# Altium schematic sheet LCD.SchDoc
size A; DocumentNumber: 7; SheetNumber: 7; SheetTotal: 12
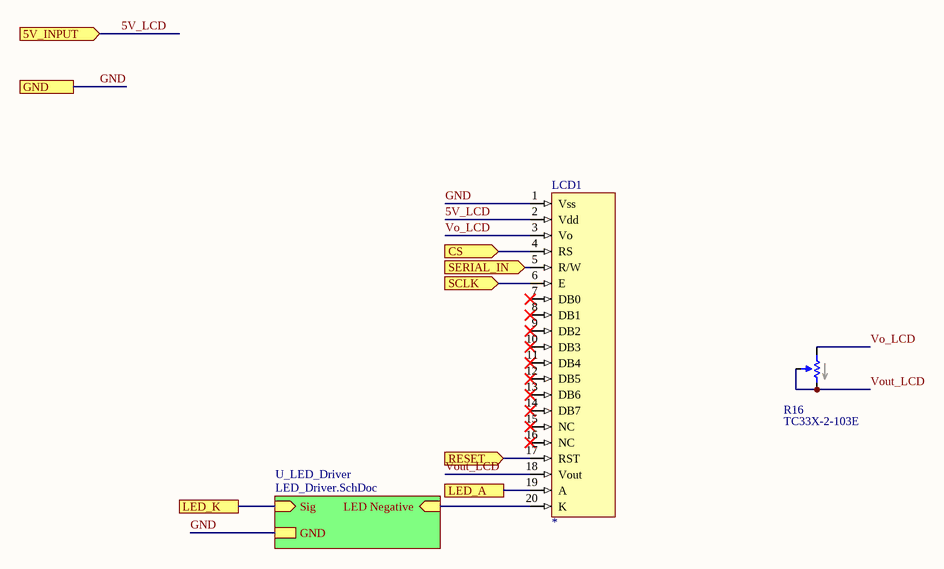
[diagram p0: LCD.SchDoc]

## Parts
LCD1  *  [CFAG12864S]
R16  TC33X-2-103E  [35WR]

## Sub-sheets
U_LED_Driver = LED_Driver.SchDoc: LED Negative (in), Sig (in), GND

## Ports
5V_INPUT (in), CS (in), GND, LED_A, LED_K, RESET (in), SCLK (in), SERIAL_IN (in)

## Nets
5V_LCD: LCD1.2(Vdd) ; port 5V_INPUT
CS: LCD1.4(RS) ; port CS
GND: LCD1.1(Vss) ; port GND, sheet U_LED_Driver/GND
LED_A: LCD1.19(A) ; port LED_A
LED_K: port LED_K, sheet U_LED_Driver/Sig
RESET: LCD1.17(RST) ; port RESET
SCLK: LCD1.6(E) ; port SCLK
SERIAL_IN: LCD1.5(R/W) ; port SERIAL_IN
Vo_LCD: LCD1.3(Vo) R16.1
Vout_LCD: LCD1.18(Vout) R16.2 R16.3
NetLCD1_20: LCD1.20(K) ; sheet U_LED_Driver/LED Negative

Not connected (* = marked no-connect by the designer): LCD1 7(DB0)* 8(DB1)* 9(DB2)* 10(DB3)* 11(DB4)* 12(DB5)* 13(DB6)* 14(DB7)* 15(NC)* 16(NC)*

## Library data of the parts
LCD1 = 41: Sunlight Readable 128x64 SPI or Parallel Graphic LCD; id: 41; vcc: 5; voltageinmax: 5.5; MfrPartNo: *; name: CFAG12864S; quantity: 0; link: https://www.crystalfontz.com/product/cfag12864syyhvt-lcd-graphical-128x64; createdby: Kevin
R16 = 1: TRIMMER 10K OHM 0.1W J LEAD TOP; MF: Bourns; id: 1; resistance: 10; voltage: 50; numcontacts: 3; numrows: 0; Digi-Key_Part_Number: TC33X-103ECT-ND; SnapEDA_Link: https://www.snapeda.com/parts/TC33X-2-103E/Bourns/view-part/?ref=snap; MP: TC33X-2-103E; Package: SOD-23 Bourns; Digi-Key_Purchase_URL: https://www.digikey.com/product-detail/en/bourns-inc/TC33X-2-103E/TC33X-103ECT-ND/612911?utm_source=snapeda&utm_medium=aggregator&utm_campaign=symbol; Value: *; Name: TC33X-2-103E; pitch: 0; quantity: 0; link: https://www.digikey.com/product-detail/en/bourns-inc/TC33X-2-103E/TC33X-103ECT-ND/612911; createdby: Kevin; createddate: 10/15/2019